# EAGLE design pj12 (EAGLE 7.4.0)
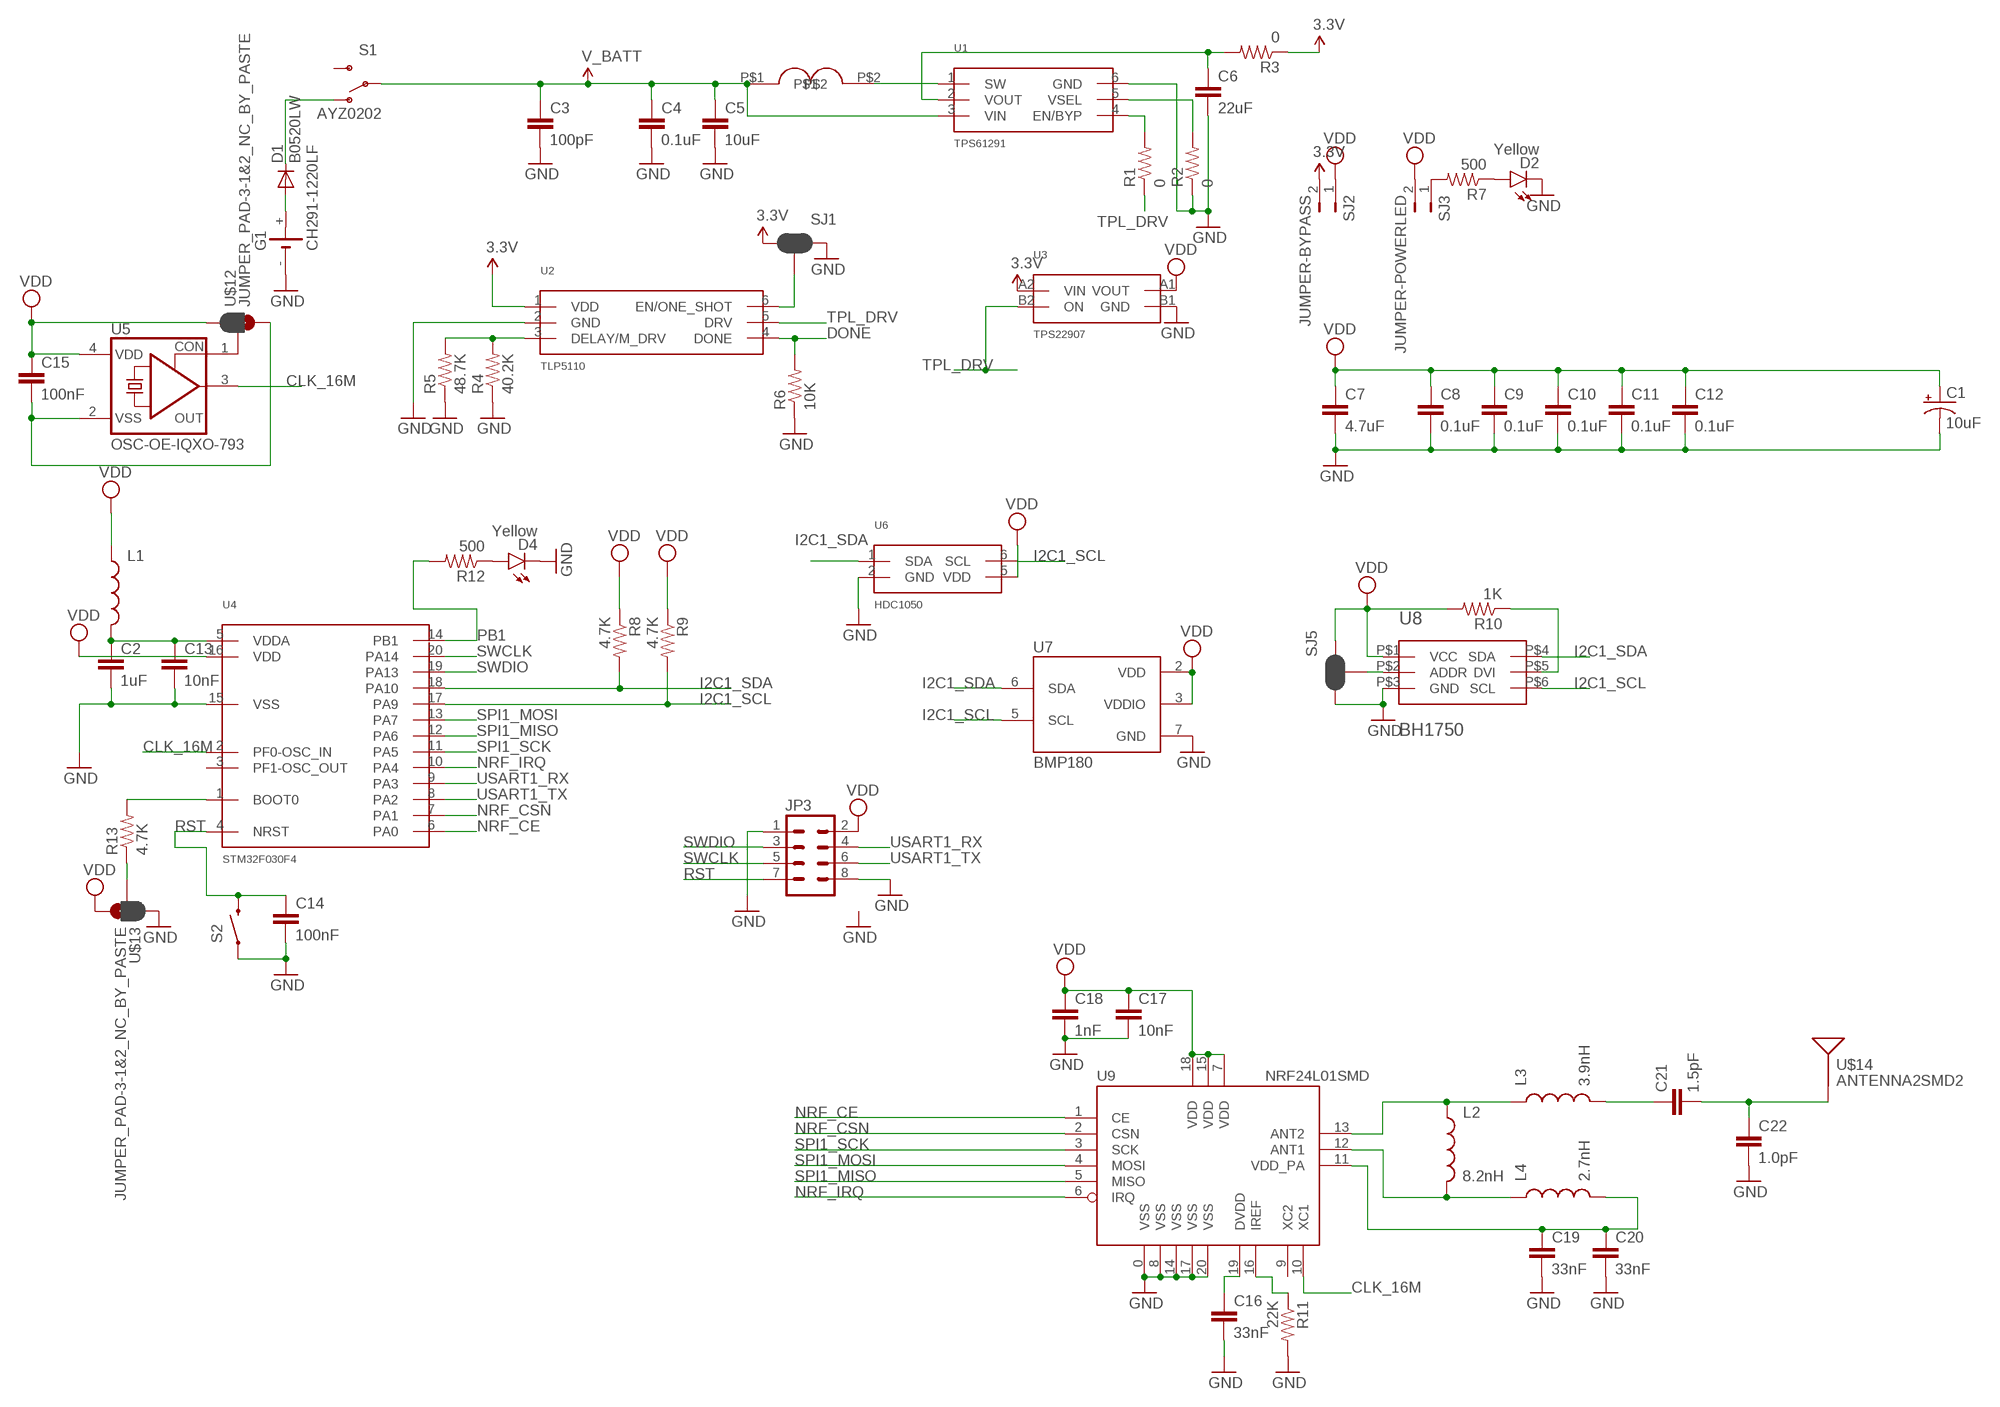
[diagram p0: schematic, sheet 1]

## Parts
C1  10uF  10UF-16V-10%(TANT)  [EIA3216]
C2  1uF  0.1UF-25V-5%(0603)  [0603-CAP]
C3  100pF  100PF-50V-5%(0603)  [0603-CAP]
C4  0.1uF  100PF-50V-5%(0603)  [0603-CAP]
C5  10uF  100PF-50V-5%(0603)  [0603-CAP]
C6  22uF  100PF-50V-5%(0603)  [0603-CAP]
C7  4.7uF  1.0UF-16V-10%(0603)  [0603-CAP]
C8  0.1uF  0.1UF-25V-5%(0603)  [0603-CAP]
C9  0.1uF  0.1UF-25V-5%(0603)  [0603-CAP]
C10  0.1uF  0.1UF-25V-5%(0603)  [0603-CAP]
C11  0.1uF  0.1UF-25V-5%(0603)  [0603-CAP]
C12  0.1uF  0.1UF-25V-5%(0603)  [0603-CAP]
C13  10nF  0.1UF-25V-5%(0603)  [0603-CAP]
C14  100nF  0.1UF-25V-5%(0603)  [0603-CAP]
C15  100nF  0.1UF-25V-5%(0603)  [0603-CAP]
C16  33nF  0.1UF-25V-5%(0603)  [0603-CAP]
C17  10nF  0.1UF-25V-5%(0603)  [0603-CAP]
C18  1nF  0.1UF-25V-5%(0603)  [0603-CAP]
C19  33nF  0.1UF-25V-5%(0603)  [0603-CAP]
C20  33nF  0.1UF-25V-5%(0603)  [0603-CAP]
C21  1.5pF  0.1UF-25V-5%(0603)  [0603-CAP]
C22  1.0pF  0.1UF-25V-5%(0603)  [0603-CAP]
D1  B0520LW  CGRM4001-G  [SOD-123_MINI-SMA]
D2  Yellow  LED-YELLOW0603  [LED-0603]
D4  Yellow  LED-YELLOW0603  [LED-0603]
G1  CH291-1220LF  [CH291-1220LF]
JP3  M04X2SMD  [2X4_SMD]
L1  INDUCTOR0603  [0603]
L2  8.2nH  INDUCTOR0603  [0603]
L3  3.9nH  INDUCTOR0603  [0603]
L4  2.7nH  INDUCTOR0603  [0603]
R1  0  1.5KOHM-1/10W-1%(0603)  [0603]
R2  0  1.5KOHM-1/10W-1%(0603)  [0603]
R3  0  1.5KOHM-1/10W-1%(0603)  [0603]
R4  40.2K  0.22OHM-1/4W-1%(0805)  [0805]
R5  48.7K  0.22OHM-1/4W-1%(0805)  [0805]
R6  10K  1.5KOHM-1/10W-1%(0603)  [0603]
R7  500  1.5KOHM-1/10W-1%(0603)  [0603]
R8  4.7K  1.5KOHM-1/10W-1%(0603)  [0603]
R9  4.7K  1.5KOHM-1/10W-1%(0603)  [0603]
R10  1K  1.5KOHM-1/10W-1%(0603)  [0603]
R11  22K  1.5KOHM-1/10W-1%(0603)  [0603]
R12  500  1.5KOHM-1/10W-1%(0603)  [0603]
R13  4.7K  1.5KOHM-1/10W-1%(0603)  [0603]
S1  AYZ0202  SWITCH-SPDTSMD  [AYZ0202]
S2  SWITCH-MOMENTARY-2SMD-REDUNDANT  [TACTILE-SWITCH-SMD]
SJ1  JUMPER-PAD-3-NC_BY_PASTE  [PAD-JUMPER-3-NC_BY_PASTE_YES_SILK_FULL_BOX]
SJ2  JUMPER-BYPASS  JUMPER-PTH-2-NO  [PTH-JUMPER-2-NO_NO_SILK]
SJ3  JUMPER-POWERLED  JUMPER-PTH-2-NO  [PTH-JUMPER-2-NO_NO_SILK]
SJ5  JUMPER-PAD-3-NC_BY_PASTE  [PAD-JUMPER-3-NC_BY_PASTE_YES_SILK_FULL_BOX]
U1  TPS61291  [DRV(S-PWSON-N6)]
U2  TLP5110  [DDC(R-PDSO-G6)]
U3  TPS22907  [YZT(S-XBGA-N4)]
U4  STM32F030F4  [TSSOP20]
U5  OSC-OE-IQXO-793  [2.5X2-4-PAD]
U6  HDC1050  [DMB(S-PWSON-N6)]
U7  BMP180  [BMP180]
U8  BH1750  [WSOF-6]
U9  NRF24L01SMD  [QFN20]
U$1  SWPA4018S3R3MT  [SWPA4018S]
U$12  JUMPER_PAD-3-1&2_NC_BY_PASTE  [PAD-HUMPER-3-1&2_NC_BY_PASTE_YES_SILK_FULL_BOX]
U$13  JUMPER_PAD-3-1&2_NC_BY_PASTE  [PAD-HUMPER-3-1&2_NC_BY_PASTE_YES_SILK_FULL_BOX]
U$14  ANTENNA2SMD2  [ANTENNA-CHIP3]

## Nets
3.3V: R3.1 SJ1.1 SJ2.2 U2.1(VDD) U3.A2(VIN)
CLK_16M: U4.2(PF0-OSC_IN) U5.3(OUT) U9.10(XC1)
DONE: R6.2 U2.4(DONE)
GND: C1.C(-) C2.2 C3.2 C4.2 C5.2 C6.2 C7.2 C8.2 C9.2 C10.2 C11.2 C12.2 C13.2 C14.2 C16.2 C17.2 C18.2 C19.2 C20.2 C22.2 D2.C D4.C G1.- JP3.1 JP3.8 R2.1 R4.1 R5.1 R6.1 R11.2 S2.1 S2.2 SJ1.3 SJ5.1 U1.6(GND) U2.2(GND) U3.B1(GND) U4.15(VSS) U6.2(GND) U7.7(GND) U8.P$3(GND) U9.0(VSS) U9.8(VSS) U9.14(VSS) U9.17(VSS) U9.20(VSS) U$13.1
I2C1_SCL: R9.2 U4.17(PA9) U6.6(SCL) U7.5(SCL) U8.P$6(SCL)
I2C1_SDA: R8.2 U4.18(PA10) U6.1(SDA) U7.6(SDA) U8.P$4(SDA)
N$1: D1.A G1.+
N$2: D1.C S1.1(O)
N$3: U1.1(SW) U$1.P$2
N$4: C6.1 R3.2 U1.2(VOUT)
N$5: R1.2 U1.4(EN/BYP)
N$6: R2.2 U1.5(VSEL)
N$7: R4.2 R5.2 U2.3(DELAY/M_DRV)
N$8: R7.2 SJ3.1
N$9: D2.A R7.1
N$10: SJ1.2 U2.6(EN/ONE_SHOT)
N$11: L2.1 L3.1 U9.13(ANT2)
N$12: SJ5.2 U8.P$2(ADDR)
N$13: R10.1 U8.P$5(DVI)
N$14: L2.2 L4.1 U9.12(ANT1)
N$15: D4.A R12.1
N$16: C15.2 U5.2(VSS) U$12.3
N$17: C2.1 C13.1 L1.2 U4.5(VDDA)
N$24: C19.1 C20.1 L4.2 U9.11(VDD_PA)
N$25: R13.1 U$13.2
N$27: R13.2 U4.1(BOOT0)
N$28: U5.1(CON) U$12.2
N$29: C16.1 U9.19(DVDD)
N$30: R11.1 U9.16(IREF)
N$32: C21.1 L3.2
N$33: C21.2 C22.1 U$14.FEED(SIGNAL)
NRF_CE: U4.6(PA0) U9.1(CE)
NRF_CSN: U4.7(PA1) U9.2(CSN)
NRF_IRQ: U4.10(PA4) U9.6(IRQ)
PB1: R12.2 U4.14(PB1)
RST: C14.1 JP3.7 S2.3 S2.4 U4.4(NRST)
SPI1_MISO: U4.12(PA6) U9.5(MISO)
SPI1_MOSI: U4.13(PA7) U9.4(MOSI)
SPI1_SCK: U4.11(PA5) U9.3(SCK)
SWCLK: JP3.5 U4.20(PA14)
SWDIO: JP3.3 U4.19(PA13)
TPL_DRV: R1.1 U2.5(DRV) U3.B2(ON)
USART1_RX: JP3.4 U4.9(PA3)
USART1_TX: JP3.6 U4.8(PA2)
V_BATT: C3.1 C4.1 C5.1 S1.2(P) U1.3(VIN) U$1.P$1
VDD: C1.A(+) C7.1 C8.1 C9.1 C10.1 C11.1 C12.1 C15.1 C17.1 C18.1 JP3.2 L1.1 R8.1 R9.1 R10.2 SJ2.1 SJ3.2 SJ5.3 U3.A1(VOUT) U4.16(VDD) U5.4(VDD) U6.5(VDD) U7.2(VDD) U7.3(VDDIO) U8.P$1(VCC) U9.7(VDD) U9.15(VDD) U9.18(VDD) U$12.1 U$13.3
Unconnected: S1.3(S) U4.3(PF1-OSC_OUT) U9.9(XC2)

## Library data of the parts
C1 = SparkFun-Capacitors:10UF-16V-10%(TANT): CAP-00811 1206/EIA-3216 Tantalum capacitor; PROD_ID: CAP-00811
C2 C13-C22 = SparkFun-Capacitors:0.1UF-25V-5%(0603): CAP-08604; PROD_ID: CAP-08604; VALUE: 0.1uF
C3 = SparkFun-Capacitors:100PF-50V-5%(0603): CAP-07883; PROD_ID: CAP-07883
C4-C6 = SparkFun-Capacitors:100PF-50V-5%(0603): CAP-07883; PROD_ID: CAP-07883; VALUE: 100pF
C7 = SparkFun-Capacitors:1.0UF-16V-10%(0603): CAP-00868; PROD_ID: CAP-00868; VALUE: 1.0uF
C8-C12 = SparkFun-Capacitors:0.1UF-25V-5%(0603): CAP-08604; PROD_ID: CAP-08604
D1 = diode:CGRM400*-G: Molded plasitc,JEDEC SOD-123/Mini SMA Source: Comchip CGRM4001-G.pdf
D2 D4 = SparkFun-LED:LED-YELLOW: Yellow SMD LEDs LilyPad 1206- DIO-09909 0603- DIO-09003 "SMART" means more efficient and expensive; PROD_ID: DIO-09003
G1 = battery:CH291-1220LF: Battery Holder, SMT, 12mm multicomp PART NO. CH291-1220LF Source: Data sheet <http://www.farnell.com/datasheets/1505860.pdf>
JP3 = SparkFun-Connectors:M04X2: .1" header, two rows of four.
L1-L4 = SparkFun-Passives:INDUCTOR: Inductors Basic Inductor/Choke - 0603 and 1206. Footprints are not proven and vary greatly between part numbers. INDUCTOR POWER 3.3UH 4.0A SMD 0.197" L x 0.197" W x 0.177" H (5.00mm x 5.00mm x 4.50mm)
R1-R3 R6-R13 = SparkFun-Resistors:1.5KOHM-1/10W-1%(0603): RES-08306; PROD_ID: RES-08306; VALUE: 1.5KOHM
R4 R5 = SparkFun-Resistors:0.22OHM-1/4W-1%(0805): RES-09883; PROD_ID: RES-09883; VALUE: 0.22
S1 = SparkFun-Electromechanical:SWITCH-SPDT: SPDT Switch Simple slide switch, Spark Fun Electronics SKU : COM-00102 DPDT SMT slide switch, AYZ0202, SWCH-08179; PROD_ID: SWCH-08179; SF_ID: COM-00597
S2 = SparkFun-Electromechanical:SWITCH-MOMENTARY-2: Various NO switches- pushbuttons, reed, etc; PROD_ID: SWCH-08247
SJ1 SJ5 = SparkFun-Passives:JUMPER-PAD-3-NC_BY_PASTE
SJ2 SJ3 = SparkFun-Passives:JUMPER-PTH-2-NO
U1 = r1:TPS61291
U2 = r1:TLP5110
U3 = r1:TPS22907
U4 = r1:STM32F030F4
U5 = IQD-Frequency-Products:OSC-OE: OSCILLATOR WITH OE
U6 = r1:HDC1050
U7 = SparkFun-Sensors:BMP180: BOSCH BMP180 DIGITAL BAROMETRIC PRESSURE SENSOR Web page: http://www.bosch-sensortec.com/en/homepage/products_3/environmental_sensors_1/bmp180_1/bmp180 Datasheet: http://ae-bst.resource.bosch.com/media/products/dokumente/bmp180/BST-BMP180-DS000-09.pdf The BMP180 is the function compatible successor of the BMP085, a new generation of high precision digital pressure sensors for consumer applications. The ultra-low power, low voltage electronics of the BMP180 is optimized for use in mobile phones, PDAs, GPS navigation devices and outdoor equipment. With a low altitude noise of merely 0.25m at fast conversion time, the BMP180 offers superior performance. The I2C interface allows for easy system integration with a microcontroller. The BMP180 is based on piezo-resistive technology for EMC robustness, high accuracy and linearity as well as long term stability. Key features: - Temperature measurement included - I2C interface - Fully calibrated - Pb-free, halogen-free and RoHS compliant, - MSL 1 Basic specs: Pressure range: 300 to 1100hPa (+9000m to -500m relating to sea level) Supply voltage: 1.8 to 3.6V (VDD), 1.62V to 3.6V (VDDIO) Package: LGA package with metal lid Small footprint: 3.6mm x 3.8mm Super-flat: 0.93mm height Low power: 5μA at 1 sample / sec. in standard mode Low noise: 0.06hPa (0.5m) in ultra low power mode, 0.02hPa (0.17m) advanced resolution mode Typical applications: - Enhancement of GPS navigation (dead-reckoning, slope detection, etc.) - In- and out-door navigation - Leisure and sports - Weather forecast - Vertical velocity indication (rise/sink speed)
U8 = User-Submitted:BH1750
U9 = SparkFun-RF:NRF24L01: 2.4GHz Low Power Transceiver This is the very popular, low cost, very low power RF transceiver from Nordic Semiconductor. Simple SPI interface. SKU: COM-00690
U$1 = User-Submitted:SWPA4018S3R3MT
U$12 U$13 = SparkFun-Passives:JUMPER_PAD-3-1&2_NC_BY_PASTE
U$14 = SparkFun-RF:ANTENNA2: Chip antenna Single endded antenna. Common with smaller chip antennas. CHIP4 package is the GPS Chip Antenna SKU: GPS-08418. CHIP5 package is 2.4GHz chip antenna SKU: WRL-00144.

## Board
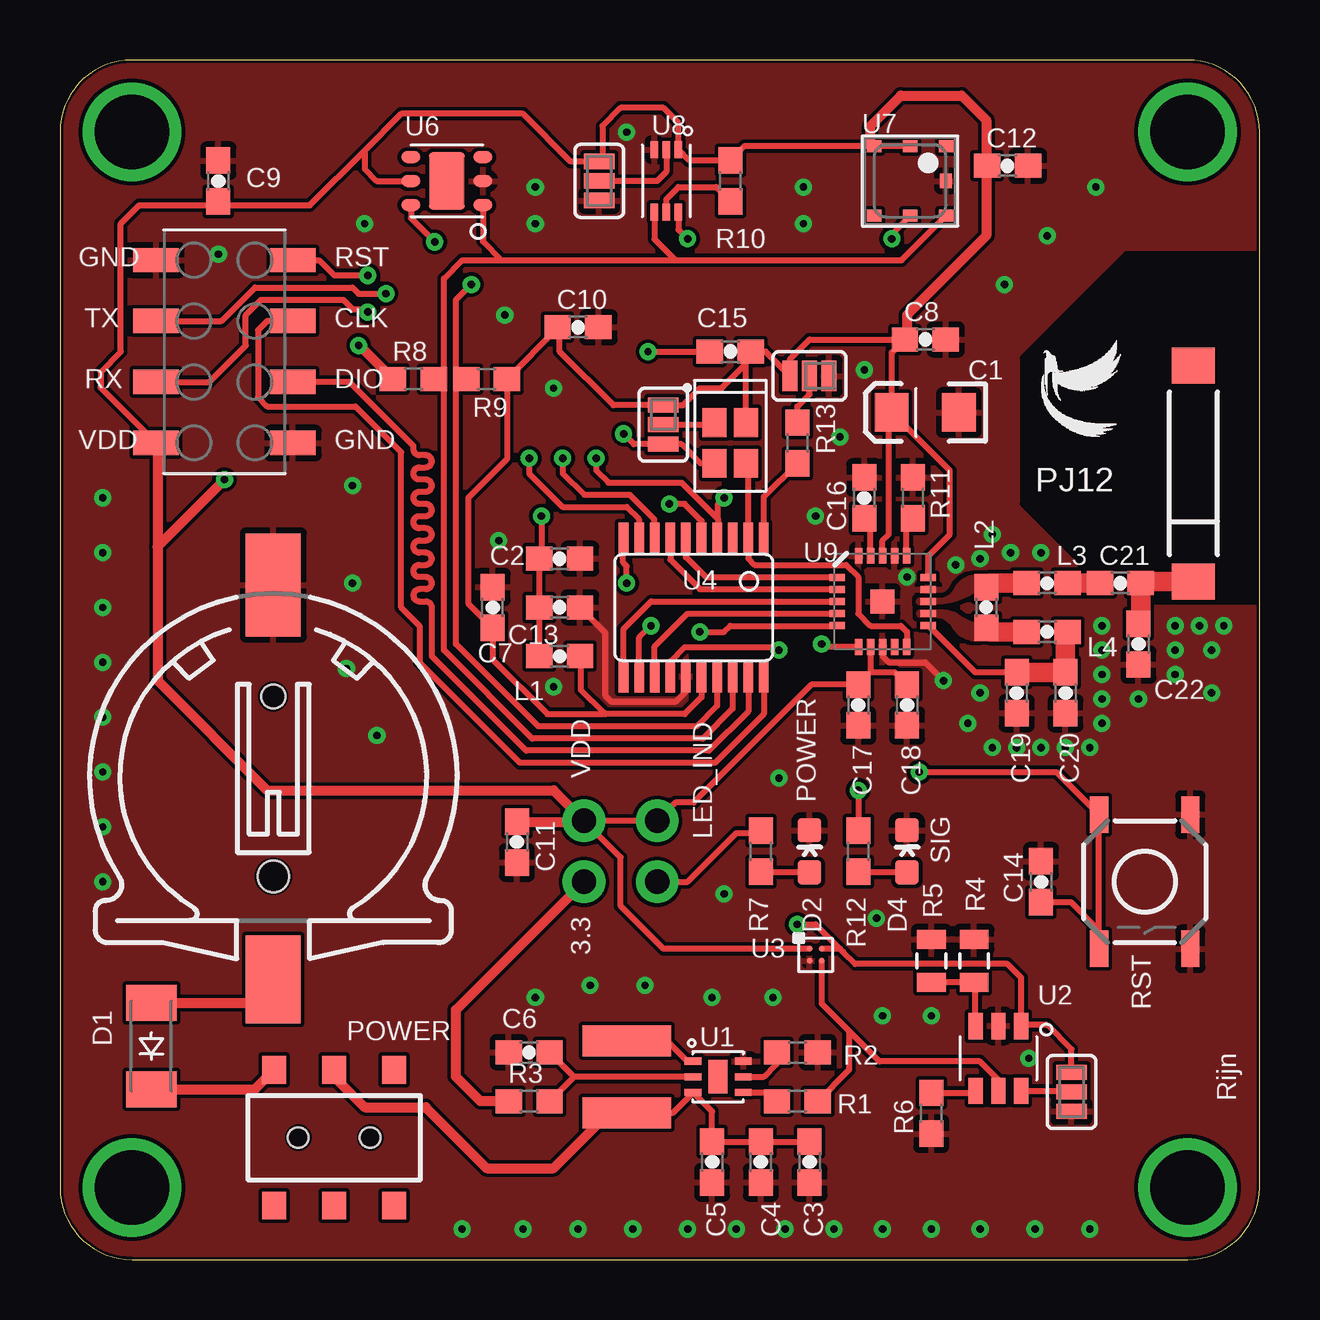
[diagram p1: board, top side]
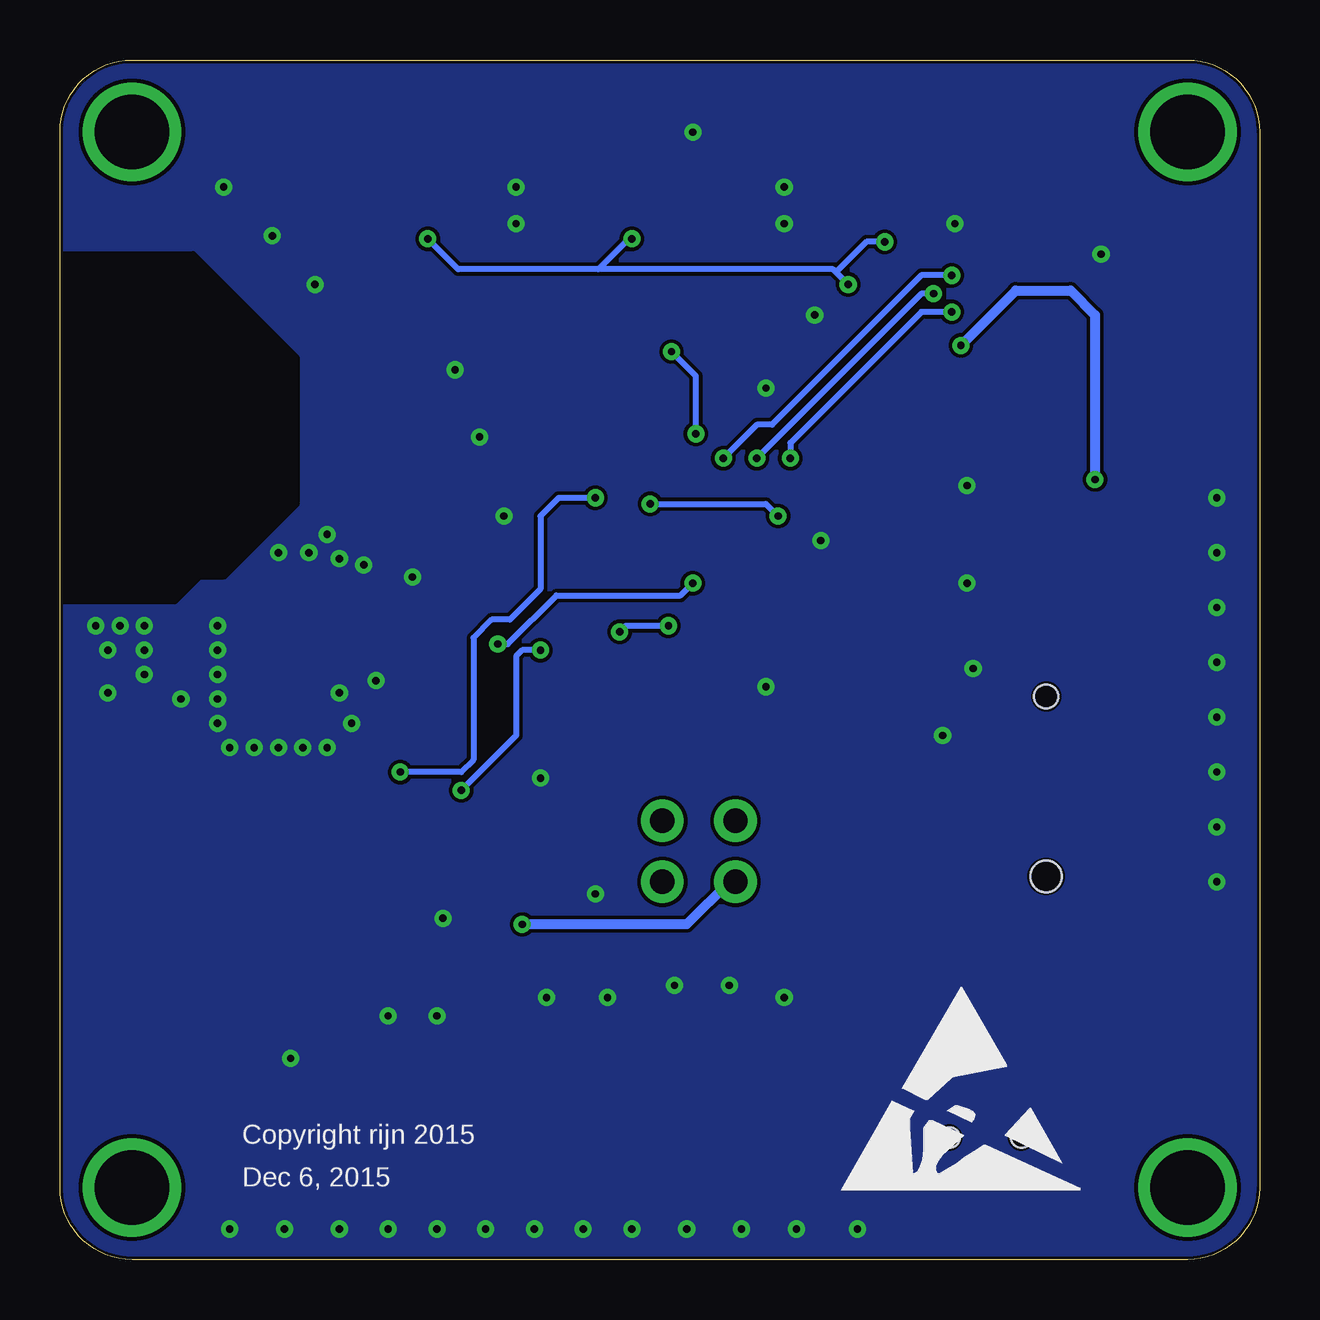
[diagram p2: board, bottom side, seen from below]

Size 50 x 50 mm. Coordinates in mm from the lower left corner, seen from the top.
Outline: 0,47 0,3 arc90 3,0 47,0 arc90 50,3 50,47 arc90 47,50 3,50 arc90 0,47
Copper layers (1*16): Top 0.035mm / dielectric 1.5mm / Bottom 0.035mm
Design rules "default *": minimum track width 6mil, minimum drill 12mil, track to track 6mil, track to pad 6mil, pad to pad 6mil, via to via 6mil, smd to smd 6mil, copper to edge 5mil, drill to drill 6mil, minimum pad ring 10mil, minimum via ring 8mil, stop-mask expansion 0mil, vias tented up to drill 15mil, thermal gap 10mil
tRestrict: area 40.1,27.4 to 52.1,41.9
bRestrict: area 40.1,27.4 to 54.4,41.9

### Footprints (pad centres in the part's own frame; a part is rotated, then mirrored left to right if it is on the bottom)
EIA3216 = smd 1.4 x 1.6: A 1.4,0; C -1.4,0
0603-CAP = smd 1.1 x 1: 1 -0.85,0; 2 0.85,0
SOD-123_MINI-SMA = smd 1.5 x 2.1: A 1.8,0; C -1.8,0
LED-0603 = smd 1 x 1: A 0,-0.877; C 0,0.877
CH291-1220LF = smd 2.3 x 3.66: + 0,-2.296 | smd 2.3 x 4.3: - 0,14.146 | hole 1.3: 0,2 | hole 1: 0,9.5
2X4_SMD = smd 1.02 x 1.9: 1 -2.54,-2.85; 2 -2.54,2.85; 3 0,-2.85; 4 0,2.85; 5 2.54,-2.85; 6 2.54,2.85; 7 5.08,-2.85; 8 5.08,2.85
0603 = smd 1.1 x 1: 1 -0.85,0; 2 0.85,0
0805 = smd 0.8 x 1.2: 1 -0.9,0; 2 0.9,0
AYZ0202 = smd 1 x 1.15: 1 -2.5,2.825; 2 0,2.825; 3 2.5,2.825; 4 -2.5,-2.825; 5 0,-2.825; 6 2.5,-2.825 | hole 0.85: 1.5,0; -1.5,0
TACTILE-SWITCH-SMD = smd 1.524 x 0.762: 1 -2.794,1.905; 2 2.794,1.905; 3 -2.794,-1.905; 4 2.794,-1.905
PAD-JUMPER-3-NC_BY_PASTE_YES_SILK_FULL_BOX = smd 0.635 x 1.27: 1 -0.813,0; 2 0,0; 3 0.813,0
PTH-JUMPER-2-NO_NO_SILK = drill 1.016 pad 1.778: 1 -1.27,0; 2 1.27,0
DRV(S-PWSON-N6) = smd 0.3 x 0.7: 1 0.65,1.05; 2 0,1.05; 3 -0.65,1.05; 4 -0.65,-1.05; 5 0,-1.05; 6 0.65,-1.05 | smd 1.4 x 0.8: NC 0,0
DDC(R-PDSO-G6) = smd 0.6 x 1.1: 1 0.95,1.35; 2 0,1.35; 3 -0.95,1.35; 4 -0.95,-1.35; 5 0,-1.35; 6 0.95,-1.35
YZT(S-XBGA-N4) = smd 0.25 x 0.25: A1 0.25,-0.25; A2 -0.25,-0.25; B1 0.25,0.25; B2 -0.25,0.25
TSSOP20 = smd 0.4 x 1.35: 1 -2.925,-2.875; 2 -2.275,-2.875; 3 -1.625,-2.875; 4 -0.975,-2.875; 5 -0.325,-2.875; 6 0.325,-2.875; 7 0.975,-2.875; 8 1.625,-2.875; 9 2.275,-2.875; 10 2.925,-2.875; 11 2.925,2.875; 12 2.275,2.875; 13 1.625,2.875; 14 0.975,2.875; 15 0.325,2.875; 16 -0.325,2.875; 17 -0.975,2.875; 18 -1.625,2.875; 19 -2.275,2.875; 20 -2.925,2.875
2.5X2-4-PAD = smd 1.2 x 1: 1 -0.85,-0.65; 2 0.85,-0.65; 3 0.85,0.65; 4 -0.85,0.65
DMB(S-PWSON-N6) = smd 0.5 x 0.8: 1 1,1.5; 2 0,1.5; 3 -1,1.5; 4 -1,-1.5; 5 0,-1.5; 6 1,-1.5 | smd 2.4 x 1.5: P$1 0,0
BMP180 = smd 0.6 x 0.5: 1 1.5,1.45; 2 0,1.45; 3 -1.5,1.45; 4 -1.5,-1.45; 5 0,-1.45; 6 1.5,-1.45 | smd 0.5 x 0.6: 7 1.5,0
WSOF-6 = smd 0.3 x 0.7: P$1 -0.5,-1.3; P$2 0,-1.3; P$3 0.5,-1.3; P$4 0.5,1.3; P$5 0,1.3; P$6 -0.5,1.3
QFN20 = smd 1 x 1: 0 0,0 | smd 0.65 x 0.3: 1 -1.9,1; 2 -1.9,0.5; 3 -1.9,0; 4 -1.9,-0.5; 5 -1.9,-1; 11 1.9,-1; 12 1.9,-0.5; 13 1.9,0; 14 1.9,0.5; 15 1.9,1 | smd 0.3 x 0.65: 6 -1,-1.9; 7 -0.5,-1.9; 8 0,-1.9; 9 0.5,-1.9; 10 1,-1.9; 16 1,1.9; 17 0.5,1.9; 18 0,1.9; 19 -0.5,1.9; 20 -1,1.9
SWPA4018S = smd 1.3 x 3.7: P$1 -1.5,0; P$2 1.5,0
PAD-HUMPER-3-1&2_NC_BY_PASTE_YES_SILK_FULL_BOX = smd 0.635 x 1.27: 1 -0.813,0; 2 0,0; 3 0.813,0
ANTENNA-CHIP3 = smd 1.8 x 1.5: FEED 0,4.5; NC 0,-4.5

### Placement (x,y rotation side)
C1  36.07,35.31 180 top
C2  20.83,29.21 0 top
C3  31.24,4.06 270 top
C4  29.21,4.06 270 top
C5  27.18,4.06 270 top
C6  19.56,8.64 180 top
C7  18.03,27.18 90 top
C8  36.07,38.35 0 top
C9  6.6,44.96 90 top
C10  21.59,38.86 0 top
C11  19.05,17.4 270 top
C12  39.5,45.59 0 top
C13  20.83,27.18 0 top
C14  40.89,15.75 90 top
C15  27.94,37.85 180 top
C16  33.53,31.75 90 top
C17  33.27,23.11 270 top
C18  35.31,23.11 270 top
C19  39.88,23.62 270 top
C20  41.91,23.62 270 top
C21  44.2,28.19 0 top
C22  44.96,25.65 270 top
D1  3.81,8.89 90 top
D2  31.24,17.02 0 top
D4  35.31,17.02 0 top
G1  8.89,13.97 0 top
JP3  6.86,36.58 90 top
L1  20.83,25.15 180 top
L2  38.61,27.18 270 top
L3  41.15,28.19 0 top
L4  41.15,26.16 0 top
R1  30.73,6.6 180 top
R2  30.73,8.64 180 top
R3  19.56,6.6 0 top
R4  38.1,12.45 270 top
R5  36.32,12.45 270 top
R6  36.32,6.1 90 top
R7  29.21,17.02 90 top
R8  14.73,36.7 0 top
R9  17.78,36.7 180 top
R10  27.94,44.96 90 top
R11  35.56,31.75 90 top
R12  33.27,17.02 90 top
R13  30.73,34.04 270 top
S1  11.43,5.08 0 top
S2  45.21,15.75 270 top
SJ1  42.16,6.99 270 top
SJ2  21.84,17.02 270 top
SJ3  24.89,17.02 90 top
SJ5  22.48,44.96 90 top
U1  27.43,7.62 90 top
U2  39.12,8.38 0 top
U3  31.5,12.7 180 top
U4  26.42,27.18 180 top
U5  27.94,34.04 270 top
U6  16.13,44.96 270 top
U7  35.43,44.96 0 top
U8  25.27,44.96 180 top
U9  34.29,27.43 0 top
U$1  23.62,7.62 90 top
U$2  [ESD_10.00]  17.53,2.79 0 bottom
U$3  [LOGO]  40.89,34.29 0 top
U$12  25.15,34.8 270 top
U$13  31.24,36.83 180 top
U$14  47.24,32.77 180 top

### Tracks (layer width: path | path; a pad name or v marks a point on that pad's centre or on a via)
3.3V  (via drill 0.3)
  Top 0.254: SJ1.1 42.16,8.76 41.15,9.78 40.11,9.78 U2.1 40.07,11.75 39.5,12.32 33.15,12.32 32.64,12.83 32.51,12.95 | 32.51,12.95 U3.A2 | v30.73,13.97 31.5,13.97 32.51,12.95
  Top 0.406: R3.1 17.53,6.6 16.51,7.62 16.51,10.41 SJ2.2
  Bottom 0.406: SJ2.2 22.1,15.75 23.88,13.97 v30.73,13.97
CLK_16M
  Top 0.254: U5.3 28.69,33.09 U4.2 28.69,29.22 28.96,28.96 32.77,28.96 33.27,28.45 33.27,26.92 33.78,26.42 35.05,26.42 35.31,26.16 35.31,25.55 U9.10
DONE
  Top 0.254: R6.2 38.08,6.95 U2.4
GND  (via drill 0.3)
  Top 0.254: U4.15 26.09,23.68 25.65,23.24 22.99,23.24 22.73,23.5 22.73,26.12 C13.2 | U9.8 34.29,25.15 34.54,24.89 36.07,24.89 v36.83,24.13
  other vias: 18.29,29.97 12.19,32.26 6.6,41.91 12.7,43.18 18.54,39.37 19.81,44.7 19.81,43.18 23.62,46.99 30.99,44.7 30.99,43.18 43.18,44.7 41.15,42.67 39.37,40.64 33.53,37.08 32.51,34.29 31.5,30.99 38.86,30.23 35.31,28.45 37.85,22.35 48.01,25.4 48.01,23.62 38.35,23.62 37.34,28.96 38.35,29.21 39.62,29.46 40.89,29.46 39.88,21.34 41.91,21.34 43.43,26.42 43.43,25.4 43.43,24.38 43.43,23.37 43.43,22.35 42.93,21.34 40.89,21.34 38.86,21.34 44.96,23.37 46.48,24.38 46.48,25.4 46.48,26.42 47.5,26.42 48.51,26.42 1.78,31.75 1.78,29.46 1.78,27.18 1.78,24.89 1.78,22.61 1.78,20.32 1.78,18.03 1.78,15.75 16.76,1.27 19.3,1.27 21.59,1.27 23.88,1.27 26.16,1.27 28.19,1.27 30.23,1.27 32.26,1.27 34.29,1.27 36.32,1.27 38.35,1.27 40.64,1.27 42.93,1.27 34.29,10.16 36.32,10.16 40.39,8.38 29.72,10.92 27.18,10.92 24.38,11.43 22.1,11.43 19.81,10.92 34.04,14.22 27.69,15.24 29.97,20.07 20.57,23.88 13.21,21.84 11.94,24.64 12.19,28.19 20.57,36.32
  pour Top (rank 6): -2.54,52.07 62.23,52.07 62.23,-3.81 -2.54,-3.81
  pour Bottom (rank 6): -5.08,57.15 57.15,57.15 57.15,-7.62 -5.08,-7.62
I2C1_SCL  (via drill 0.3)
  Top 0.254: U4.17 27.39,23.07 26.54,22.23 19.94,22.23 16.51,25.65 16.51,36.83 | 16.51,36.83 16.51,40.01 v17.14,40.64 | v34.67,42.55 34.67,42.75 U7.5 | U8.P$6 25.77,42.93 v26.16,42.55 | U6.6 14.63,43.41 v15.62,42.42 | R9.2 16.64,36.7 16.51,36.83
  Bottom 0.254: v17.14,40.64 17.65,41.15 | 17.65,41.15 17.78,41.27 27.56,41.27 | 27.56,41.27 33.4,41.27 v34.67,42.55 | v26.16,42.55 26.29,42.55 27.56,41.27 | v15.62,42.42 16.38,42.42 17.65,41.15
I2C1_SDA
  Top 0.254: U4.18 28.04,22.96 26.8,21.72 19.68,21.72 16,25.4 16,36.7 | R8.2 16,36.7 | 16,36.7 16,40.89 16.76,41.66 18.41,41.66 | 18.41,41.66 25.65,41.66 | 25.65,41.66 35.08,41.66 U7.6 | U6.1 17.63,42.44 18.41,41.66 | U8.P$4 24.77,42.54 25.65,41.66
N$1
  Top 0.406: D1.A 7.91,10.69 G1.+
N$2
  Top 0.406: D1.C 8.12,7.09 S1.1
N$3
  Top 0.254: U1.1 26.15,8.27 25.4,9.02 23.73,9.02 U$1.P$2
N$4
  Top 0.254: U1.2 21.42,7.62 | 21.42,7.62 C6.1 | R3.2 21.42,7.62
N$5
  Top 0.254: U1.4 29.52,6.97 R1.2
N$6
  Top 0.254: U1.5 29.34,7.62 29.84,8.13 29.84,8.6 R2.2
N$7
  Top 0.254: U2.3 38.17,11.48 R4.2 R5.2
N$8
  Top 0.254: SJ3.1 26.16,15.75 28.19,17.78 29.12,17.78 R7.2
N$9
  Top 0.254: D2.A 29.24,16.14 R7.1
N$10
  Top 0.254: U2.6 42.12,7.03 SJ1.2
N$11
  Top 0.813: L2.1 38.77,28.19 L3.1
  pour Top (no thermals): 35.86,27.58 36.5,27.58 arc80 37.31,28.02 arc-72 38.53,28.55 arc-193 38.53,27.76 arc31 38.1,27.76 arc-29 36.58,27.3 arc7 35.86,27.28 arc-187
N$12
  Top 0.254: U8.P$2 25.27,45.34 24.89,44.96 SJ5.2
N$13
  Top 0.254: U8.P$5 25.27,44.2 25.78,44.7 27.34,44.7 R10.1
N$14
  Top 0.813: L2.2 38.77,26.16 L4.1
  pour Top (no thermals): 35.86,26.77 36.5,26.77 arc-61 37.19,26.37 arc57 38.18,25.78 arc188 38.13,26.54 arc-22 37.31,26.97 arc22 36.53,27.08 arc-8 35.86,27.08 arc188
N$15
  Top 0.254: D4.A 33.3,16.14 R12.1
N$16  (via drill 0.3)
  Top 0.254: U5.2 26.71,33.19 25.91,33.98 U$12.3 23.93,33.98 v23.5,34.42 | v24.51,37.85 C15.2
  Bottom 0.254: v23.5,34.42 23.5,36.83 v24.51,37.85
N$17  (via drill 0.3)
  Top 0.254: U4.5 26.74,30.79 26.04,31.5 v25.4,31.5 | v20.07,30.99 20.07,29.3 C2.1 C13.1 L1.2
  Bottom 0.254: v25.4,31.5 20.57,31.5 v20.07,30.99
N$18  (via drill 3.1)
  other vias: 3,47
N$19  (via drill 3.1)
  other vias: 47,47
N$20  (via drill 3.1)
  other vias: 3,3
N$21  (via drill 3.1)
  other vias: 47,3
N$24
  Top 0.254: C19.1 38.15,24.47 U9.11
  Top 0.813: L4.2 41.91,26.07 C20.1 C19.1
N$25
  Top 0.254: R13.1 30.73,35.56 31.24,36.07 U$13.2
N$27
  Top 0.254: U4.1 29.34,31.79 R13.2
N$28
  Top 0.254: U$12.2 27.2,34.8 U5.1
N$29
  Top 0.254: U9.19 33.79,30.64 C16.1
N$30
  Top 0.254: U9.16 35.29,30.63 R11.1
N$32
  Top 0.813: L3.2 C21.1
N$33
  Top 0.813: U$14.FEED 45.12,28.27 C21.2 45.05,26.59 C22.1
NRF_CE
  Top 0.254: U4.6 26.09,29.28 26.92,28.45 32.37,28.45 U9.1
NRF_CSN
  Top 0.254: U4.7 25.44,29.17 26.67,27.94 U9.2
NRF_IRQ  (via drill 0.3)
  Top 0.254: U9.6 31.87,25.53 v31.75,25.65 | v23.62,28.19 23.62,28.91 23.47,29.06 23.47,30.03 U4.10
  Bottom 0.254: v31.75,25.65 31.34,25.65 29.31,27.69 24.13,27.69 v23.62,28.19
PB1  (via drill 0.3)
  Top 0.254: U4.14 25.44,24.93 26.04,25.53 29.84,25.53 v29.97,25.4 | v33.27,19.56 R12.2
  Bottom 0.254: v29.97,25.4 30.73,25.4 30.99,25.15 30.99,21.84 v33.27,19.56
RST  (via drill 0.3)
  Top 0.254: JP3.7 10.79,41.66 11.43,41.02 v12.83,41.02 | v22.35,33.4 22.35,32.89 22.86,32.38 25.91,32.38 27.43,30.86 | 27.43,30.86 27.43,30.09 U4.4 | 27.43,30.86 27.43,31.5 v27.69,31.75 | v35.81,20.32 41.53,20.32 S2.3 43.31,13.72 | S2.4 43.31,13.72 | C14.1 42.12,14.9 43.31,13.72
  Bottom 0.254: v12.83,41.02 14.1,41.02 20.32,34.8 20.95,34.8 v22.35,33.4 | v27.69,31.75 29.21,31.75 29.97,30.99 29.97,27.94 31.24,26.67 32,26.67 32.77,25.91 32.77,20.83 33.27,20.32 v35.81,20.32
SPI1_MISO  (via drill 0.3)
  Top 0.254: U4.12 24.14,25.92 v24.64,26.42 | v26.67,26.16 27.69,26.16 27.94,26.42 32.37,26.42 U9.5
  Bottom 0.254: v24.64,26.42 26.42,26.42 v26.67,26.16
SPI1_MOSI
  Top 0.254: U4.13 24.79,25.55 26.16,26.92 U9.4
SPI1_SCK
  Top 0.254: U4.11 23.49,26.29 24.64,27.43 U9.3
SWCLK
  Top 0.254: U4.20 29.34,22.74 27.3,20.7 19.18,20.7 14.99,24.89 14.99,26.42 14.22,27.18 14.22,33.66 12.32,35.56 8.64,35.56 8.26,35.94 8.26,38.73 8.64,39.12 JP3.5
SWDIO
  Top 0.254: U4.19 28.69,22.85 27.05,21.21 19.43,21.21 15.49,25.15 15.49,27.18 arc90 15.24,27.43 14.99,27.43 arc-90 14.73,27.69 arc-90 14.99,27.94 15.24,27.94 arc90 15.49,28.19 arc90 15.24,28.45 14.99,28.45 arc-90 14.73,28.7 arc-90 14.99,28.96 15.24,28.96 arc90 15.49,29.21 arc90 15.24,29.46 14.99,29.46 arc-90 14.73,29.72 arc-90 14.99,29.97 15.24,29.97 arc90 15.49,30.23 arc90 15.24,30.48 14.99,30.48 arc-90 14.73,30.73 arc-90 14.99,30.99 15.24,30.99 arc90 15.49,31.24 arc90 15.24,31.5 14.99,31.5 arc-90 14.73,31.75 arc-90 14.99,32 15.24,32 arc90 15.49,32.26 arc90 15.24,32.51 14.99,32.51 arc-90 14.73,32.77 arc-90 14.99,33.02 15.24,33.02 arc90 15.49,33.27 arc90 15.24,33.53 14.99,33.53 arc-90 14.73,33.78 14.73,33.91 12.06,36.58 JP3.3
TPL_DRV
  Top 0.254: U3.B2 31.75,10.67 32.83,9.59 32.89,9.53 | 32.89,9.53 32.89,7.91 R1.1 | U2.5 39.12,7.49 38.35,8.26 34.16,8.26 32.89,9.53
USART1_RX  (via drill 0.3)
  Top 0.254: JP3.4 6.22,36.58 7.75,38.1 7.75,39.37 8.38,40.01 11.81,40.01 12.19,39.62 12.7,39.62 v12.83,39.5 | v19.56,33.4 19.56,32.77 20.95,31.37 23.62,31.37 24.13,30.86 24.13,30.06 U4.9
  Bottom 0.254: v12.83,39.5 14.1,39.5 19.56,34.04 v19.56,33.4
USART1_TX  (via drill 0.3)
  Top 0.254: JP3.6 6.73,39.12 8.13,40.51 12.19,40.51 12.45,40.26 v13.59,40.26 | v20.95,33.4 20.95,32.77 21.84,31.88 23.75,31.88 24.77,30.86 24.77,30.08 U4.8
  Bottom 0.254: v13.59,40.26 14.1,40.26 v20.95,33.4
V_BATT
  Top 0.254: 23.6,6.1 25.53,6.1 26.38,6.95 U1.3 27.18,6.17 C5.1 C4.1 C3.1 | 22.86,6.1 23.6,6.1 | 23.6,6.1 U$1.P$1
  Top 0.406: S1.2 11.43,7.62 12.7,6.35 15.24,6.35 17.78,3.81 20.57,3.81 22.86,6.1
VDD  (via drill 0.3)
  Top 0.254: U9.7 33.79,24.48 | 33.79,24.48 C17.1 31.33,23.96 26.42,19.05 25.65,19.05 SJ3.2 SJ2.1 23.37,16.76 23.37,14.73 25.15,12.95 U3.A1 | 33.79,24.48 34.79,24.48 C18.1 | U4.16 26.74,23.44 26.04,22.73 22.73,22.73 22.67,22.8 | 22.67,22.8 21.72,23.75 21.72,25.11 L1.1 | 22.67,22.8 22.61,22.73 20.32,22.73 18.03,25.02 C7.1 17.02,27.34 17.02,31.75 18.63,33.36 R9.1 20.74,38.81 C10.1 20.83,38.77 20.83,37.85 23.06,35.61 U$12.1 25.96,35.61 26.67,36.32 27.57,36.32 28.59,37.34 | U9.18 34.29,29.97 34.54,30.23 34.54,35.18 C1.A | C1.A 34.67,37.8 C8.1 | C8.1 31.24,38.35 30.43,37.54 U$13.3 29.41,37.85 C15.1 28.59,37.65 28.59,37.34 | U5.4 28.59,37.34 | U7.2 U7.3 | U7.3 28.54,46.41 R10.2 26.22,45.81 U8.P$1 25.77,47.38 25.15,48.01 23.37,48.01 22.61,47.24 22.61,45.9 SJ5.3 21.29,45.77 19.3,47.75 14.22,47.75 12.7,46.23 | 12.7,46.23 12.7,45.47 13.21,44.96 U6.5 | 6.6,43.94 3.3,43.94 2.54,43.18 2.54,37.85 1.69,37 1.69,36.35 JP3.2 4.06,34.04 | 6.6,43.94 10.41,43.94 12.7,46.23 | C12.1 38.61,45.59 | 33.78,46.48 33.86,46.48 U7.3 | C8.1 35.22,38.77 35.31,38.86 | U9.15 36.19,29.33 37.08,30.23 37.08,32.89 C1.A | C9.1 6.6,43.94
  Top 0.406: 4.06,34.04 4.06,29.72 | 4.06,29.72 4.06,24.13 8.64,19.56 20.57,19.56 SJ2.1 21.8,18.25 C11.1 | v6.86,32.51 4.06,29.72 | 33.78,46.48 33.78,47.24 35.05,48.51 37.59,48.51 38.61,47.5 38.61,45.59 38.61,42.67 35.31,39.37 35.31,38.86 35.31,38.35 | v12.45,38.1 12.48,38.1 R8.1
  Bottom 0.406: v12.45,38.1 10.16,40.39 7.87,40.39 6.86,39.37 v6.86,32.51

### Text on the board
tNames: GND | RST | TX | CLK | RX | DIO | VDD | GND | PJ12 | VDD | POWER | LED_IND | SIG | 3.3 | RST | POWER | Rijn
bNames: Copyright rijn 2015 | Dec 6, 2015